# Altium schematic sheet Sheet2.SchDoc
size A4
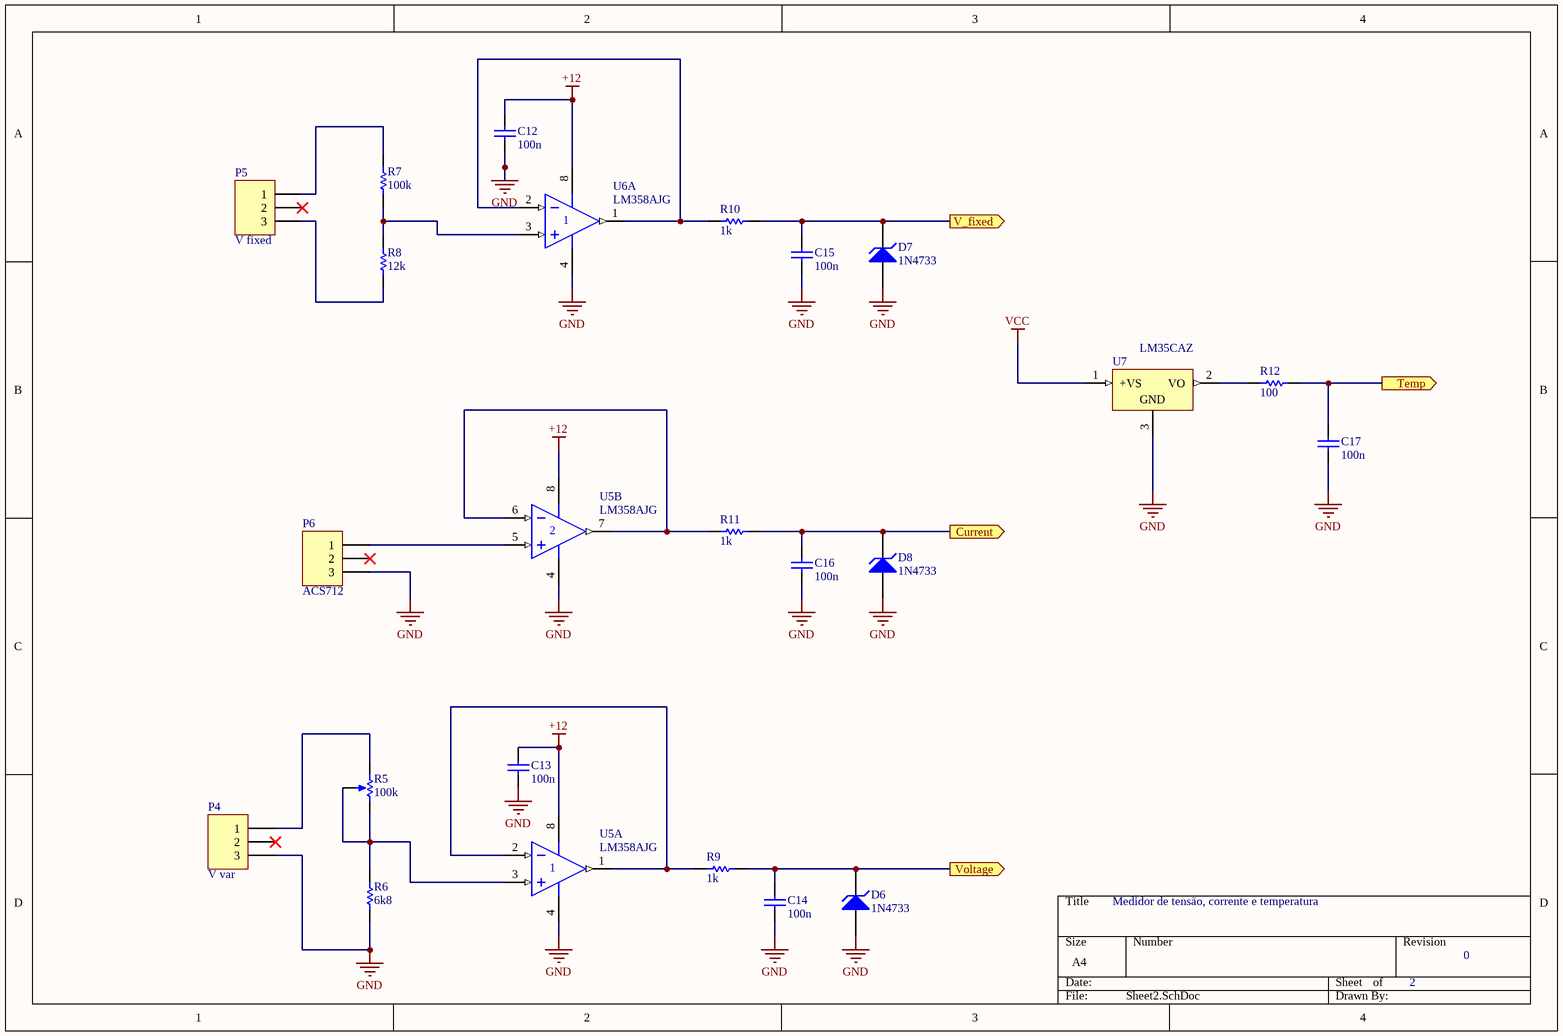
[diagram p0: Sheet2.SchDoc]

## Parts
C12  100n  [RAD-0.2]
C13  100n  [RAD-0.2]
C14  100n  [RAD-0.2]
C15  100n  [RAD-0.2]
C16  100n  [RAD-0.2]
C17  100n  [RAD-0.2]
D6  1N4733  [DIODE-SIGNAL]
D7  1N4733  [DIODE-SIGNAL]
D8  1N4733  [DIODE-SIGNAL]
P4  V var  [HDR1X3]
P5  V fixed  [HDR1X3]
P6  ACS712  [HDR1X3]
R5  100k  [VR1]
R6  6k8  [AXIAL-0.4]
R7  100k  [AXIAL-0.4]
R8  12k  [AXIAL-0.4]
R9  1k  [AXIAL-0.4]
R10  1k  [AXIAL-0.4]
R11  1k  [AXIAL-0.4]
R12  100  [AXIAL-0.4]
U5  LM358AJG  [JG008]  (parts A,B of 2)
U6  LM358AJG  [JG008]  (part A of 2)
U7  LM35CAZ  [Z03A]

## Ports
Current (out), Temp (out), V_fixed (out), Voltage (out)

## Nets
+12: C12.1 C13.1 U5.8(V+) U6.8(V+)
GND: C12.2 C13.2 C14.2 C15.2 C16.2 C17.2 D6.1(A) D7.1(A) D8.1(A) P4.3 P6.3 R6.1 U5.4(V-) U6.4(V-) U7.3(GND)
VCC: U7.1(+VS)
Current: C16.1 D8.2(K) R11.2 ; port Current
Temp: C17.1 R12.2 ; port Temp
V_fixed: C15.1 D7.2(K) R10.2 ; port V_fixed
Voltage: C14.1 D6.2(K) R9.2 ; port Voltage
NetP4_1: P4.1 R5.1(TOP)
NetP5_1: P5.1 R7.2
NetP5_3: P5.3 R8.1
NetP6_1: P6.1 U5.5(IN+)
NetR5_2: R5.2(BOT) R5.3(TAP) R6.2 U5.3(IN+)
NetR7_1: R7.1 R8.2 U6.3(IN+)
NetR9_1: R9.1 U5.1(OUT) U5.2(IN-)
NetR10_1: R10.1 U6.1(OUT) U6.2(IN-)
NetR11_1: R11.1 U5.6(IN-) U5.7(OUT)
NetR12_1: R12.1 U7.2(VO)

Not connected (* = marked no-connect by the designer): P4 2*; P5 2*; P6 2*

## Notes on the sheet
- Medidor de tensão, corrente e temperatura
- 2
- 0

## Library data of the parts
C12-C17 = C: Capacitor; Value: 1; Manufacturer: *; PartNumber: *; Package Type: *
D6-D8 = D Zener: Zener Diode; Manufacturer: *; PartNumber: *; Package Type: *
P4-P6 = Header 3: Header, 3-Pin; LatestRevisionDate: 17-Jul-2002; LatestRevisionNote: Re-released for DXP Platform.; Publisher: Altium Limited
R5 = R Pot: Potentiometer; Manufacturer: *; PartNumber: *; Package Type: *; Value: *; Set Position: *
R6-R12 = R: Resistor; Value: 0; Manufacturer: *; PartNumber: *; Package Type: *
U5 U6 = LM358AJG: Dual Operational Amplifier; Published: 15-Apr-2002; LatestRevisionDate: 04-Mar-2005; LatestRevisionNote: Stylized 3D Model Added.; DatasheetVersion: Aug-1988; PackageVersion: Jan-1995; PackageReference: JG008; Publisher: Altium Limited; PackageDescription: DIP; 8 Leads; Row Spacing 7.62 mm; Pitch 2.54 mm; ComponentLink1Description: Manufacturer Link; ComponentLink1URL: http://www.ti.com/
U7 = LM35CAZ: Precision Centigrade Temperature Sensor, 3-pin TO-92; Manufacturer: National Semiconductor; PackageTopMarking: NSXYTT*LM35*CAZ; PowerWise: N; CompType: Temp Sensor IC; Published: 4-Dec-2008; LatestRevisionDate: 15-Jul-2009; LatestRevisionNote: Sch pins 1 & 3 reversed.; DatasheetVersion: Nov-2000; PackageVersion: revG, Sep-2000; PackageReference: Z03A; Publisher: Altium Limited; PackageDescription: TO-92, Molded, 3 Lead; Supplier 1: Farnell; Supplier Part Number 1: 9494529; PartNumber: LM35CAZ; RoHS: N; PinCount: 3; Code_JEDEC: TO-226-AA; ComponentLink1Description: LM35 Datasheet; ComponentLink1URL: http://www.national.com/ds/LM/LM35.pdf; ComponentLink2Description: LM35 Web Page; ComponentLink2URL: http://www.national.com/pf/LM/LM35.html; ComponentLink3Description: Z03A Package Page; ComponentLink3URL: http://www.national.com/packaging/folders/z03a.html